# Altium schematic sheet 5_PROFIBUS2.schdoc
size 307 x 218 mm; Symbol: Drawing-Symbol_A4; Device: Drawing-Symbol_A4; Company: 嘉立创EDA; Version: V1.0; Page Size: A4; @Project Name: 工程文件; @Page Count: 7; @Update Date: 2025-06-13; @Create Date: 2025-06-13; @Schematic Name: Schematic1; @Page No: 5; @Page Name: PROFIBUS2; @Create Time: 08:49:33; @Update Time: 16:51:49; Width: 1170; Height: 825; Region Start: 1; X Region Count: 6; Y Region Count: 4; Blade Width: 10; Title Block Position: 3; @Board Name: Board1
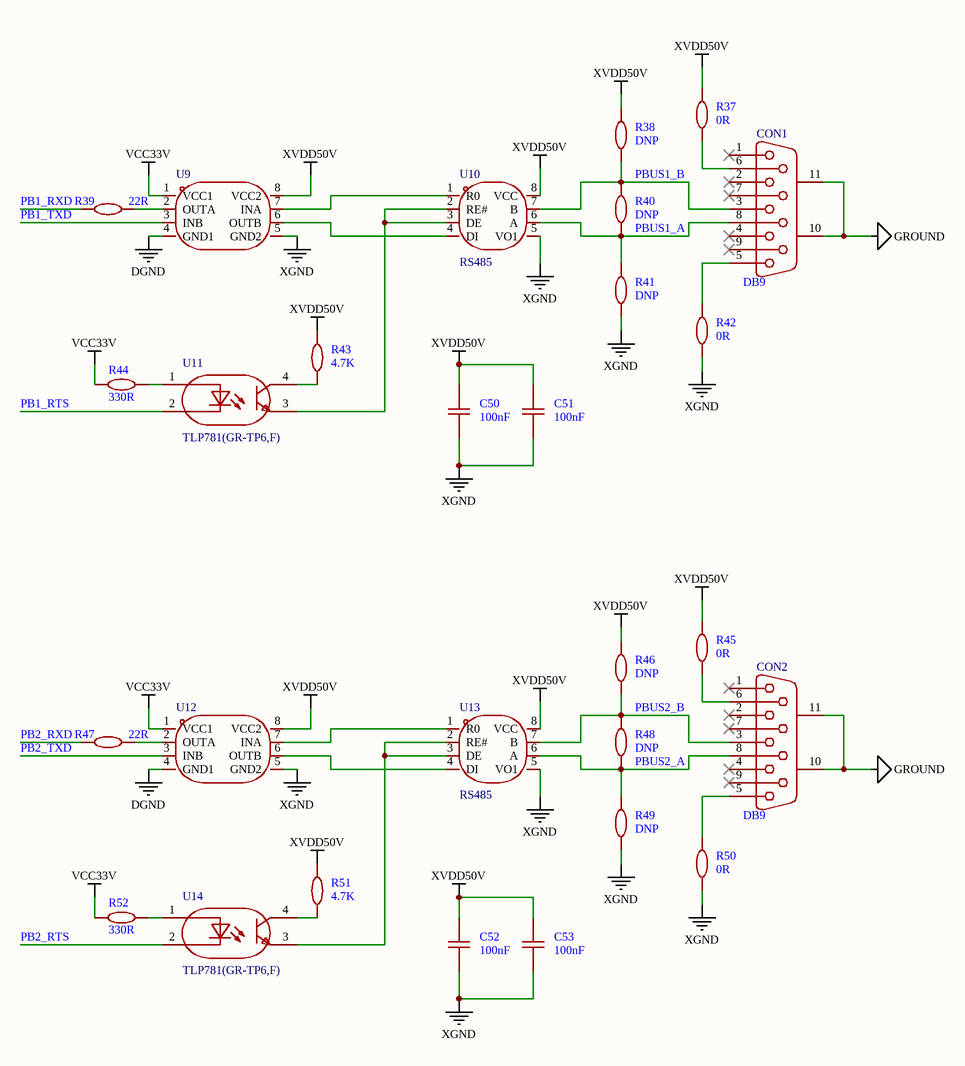
[diagram p0: 5_PROFIBUS2.schdoc]

## Parts
C50  100nF  [C0402]
C51  100nF  [C0402]
C52  100nF  [C0402]
C53  100nF  [C0402]
CON1  DB9  [DB9-TH_DT10121-M5N3-4F]
CON2  DB9  [DB9-TH_DT10121-M5N3-4F]
R37  0R  [R0805]
R38  DNP  [R0805]
R39  22R  [R0402]
R40  DNP  [R0805]
R41  DNP  [R0805]
R42  0R  [R0805]
R43  4.7K  [R0402]
R44  330R  [R0402]
R45  0R  [R0805]
R46  DNP  [R0805]
R47  22R  [R0402]
R48  DNP  [R0805]
R49  DNP  [R0805]
R50  0R  [R0805]
R51  4.7K  [R0402]
R52  330R  [R0402]
U9  (no value)  [SOIC-8_L5.0-W4.0-P1.27-LS6.0-BL]
U10  (no value)  [SOP-8_L4.9-W3.9-P1.27-LS6.0-BL]
U11  (no value)  [SOP-4_L6.5-W4.6-P2.54-LS10.3-TL]
U12  (no value)  [SOIC-8_L5.0-W4.0-P1.27-LS6.0-BL]
U13  (no value)  [SOP-8_L4.9-W3.9-P1.27-LS6.0-BL]
U14  (no value)  [SOP-4_L6.5-W4.6-P2.54-LS10.3-TL]

## Nets
DGND: U9.4(GND1) U12.4(GND1)
GROUND: CON1.10(MH1) CON1.11(MH2) CON2.10(MH1) CON2.11(MH2)
VCC33V: R44.1 R52.1 U9.1(VCC1) U12.1(VCC1)
XGND: C50.1 C51.1 C52.1 C53.1 R41.1 R42.1 R49.1 R50.1 U9.5(GND2) U10.5(VO1) U12.5(GND2) U13.5(VO1)
XVDD50V: C50.2 C51.2 C52.2 C53.2 R37.1 R38.2 R43.2 R45.1 R46.2 R51.2 U9.8(VCC2) U10.8(VCC) U12.8(VCC2) U13.8(VCC)
PB1_RTS: U11.2
PB1_RXD: R39.1
PB1_TXD: U9.3(INB)
PB2_RTS: U14.2
PB2_RXD: R47.1
PB2_TXD: U12.3(INB)
PBUS1_A: CON1.8 R40.1 R41.2 U10.6(A)
PBUS1_B: CON1.3 R38.1 R40.2 U10.7(B)
PBUS2_A: CON2.8 R48.1 R49.2 U13.6(A)
PBUS2_B: CON2.3 R46.1 R48.2 U13.7(B)
NetCON1_5: CON1.5 R42.2
NetCON1_6: CON1.6 R37.2
NetCON2_5: CON2.5 R50.2
NetCON2_6: CON2.6 R45.2
NetR39_2: R39.2 U9.2(OUTA)
NetR43_1: R43.1 U11.4
NetR44_2: R44.2 U11.1
NetR47_2: R47.2 U12.2(OUTA)
NetR51_1: R51.1 U14.4
NetR52_2: R52.2 U14.1
NetU9_6: U9.6(OUTB) U10.4(DI)
NetU9_7: U9.7(INA) U10.1(R0)
NetU10_2: U10.2(RE#) U10.3(DE) U11.3
NetU12_6: U12.6(OUTB) U13.4(DI)
NetU12_7: U12.7(INA) U13.1(R0)
NetU13_2: U13.2(RE#) U13.3(DE) U14.3

Not connected (* = marked no-connect by the designer): CON1 1* 2* 4* 7* 9*; CON2 1* 2* 4* 7* 9*

## Notes on the sheet
- 1
- 2
- 3
- 4
- 5
- 6
- A
- B
- C
- D

## Library data of the parts
C50-C53 = CAP_0402: Symbol: CapAcitance; Convert to PCB: yes; Device: CAP_0402; Add into BOM: yes; Value: 100nF
CON1 CON2 = DB9 TH90: Add into BOM: yes; Symbol: DB9 TH90; Device: DB9 TH90; Manufacturer Part: DB9; Convert to PCB: yes
R37 R38 R40-R42 R45 R46 R48-R50 = Res_0805: Symbol: 电阻; Convert to PCB: yes; Device: Res_0805; Add into BOM: yes
  R37 R42 R45 R50: Value: 0R
  R38 R40 R41 R46 R48 R49: Value: DNP
R39 R43 R44 R47 R51 R52 = Res_0402: Symbol: 电阻; Convert to PCB: yes; Device: Res_0402; Add into BOM: yes
  R39 R47: Value: 22R
  R43 R51: Value: 4.7K
  R44 R52: Value: 330R
U9 U12 = ISO7221AD: Add into BOM: yes; Symbol: ISO7221AD; Device: ISO7221AD; Convert to PCB: yes
U10 U13 = RS485: Add into BOM: yes; Symbol: RS485; Device: RS485; Convert to PCB: yes
U11 U14 = TLP781(GR-TP6,F): Symbol: TLP781(GR-TP6，F); Add into BOM: yes; Device: TLP781(GR-TP6,F); Convert to PCB: yes